# EAGLE schematic Thermistor-Connector (EAGLE 6.6.0)
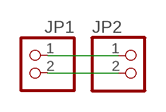
[diagram p0: schematic, sheet 1]

## Parts
JP1  PINHD-1X2  [1X02]
JP2  PINHD-1X2  [1X02]

## Nets
N$1: JP1.1 JP2.1
N$2: JP1.2 JP2.2

## Library data of the parts
JP1 JP2 = pinhead:PINHD-1X2: PIN HEADER